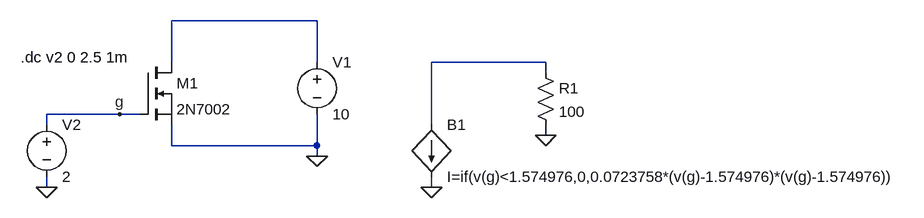
[diagram p0: schematic MOS curvas.asc]
MOS curvas.asc, the LTspice schematic file:
Version 4
SHEET 1 1440 680
WIRE 432 80 208 80
WIRE 208 144 208 80
WIRE 432 144 432 80
WIRE 784 144 608 144
WIRE 784 160 784 144
WIRE 128 224 16 224
WIRE 160 224 128 224
WIRE 16 240 16 224
WIRE 608 240 608 144
WIRE 784 256 784 240
WIRE 208 272 208 240
WIRE 432 272 432 224
WIRE 432 272 208 272
WIRE 432 288 432 272
WIRE 16 336 16 320
WIRE 608 336 608 320
FLAG 432 288 0
FLAG 16 336 0
FLAG 128 224 g
FLAG 608 336 0
FLAG 784 256 0
SYMBOL nmos 160 144 R0
SYMATTR InstName M1
SYMATTR Value 2N7002
SYMBOL voltage 432 128 R0
WINDOW 123 0 0 Left 2
WINDOW 39 0 0 Left 2
SYMATTR InstName V1
SYMATTR Value 10
SYMBOL voltage 16 224 R0
WINDOW 123 0 0 Left 2
WINDOW 39 0 0 Left 2
SYMATTR InstName V2
SYMATTR Value 2
SYMBOL bi 608 240 R0
SYMATTR InstName B1
SYMATTR Value I=if(v(g)<1.574976,0,0.0723758*(v(g)-1.574976)*(v(g)-1.574976))
SYMBOL res 768 144 R0
SYMATTR InstName R1
SYMATTR Value 100
TEXT -24 136 Left 2 !.dc v2 0 2.5 1m

The netlist it stands for:
* MOS curvas.asc
M1 N001 g 0 0 2N7002
V1 N001 0 10
V2 g 0 2
B1 N002 0 I=if(v(g)<1.574976,0,0.0723758*(v(g)-1.574976)*(v(g)-1.574976))
R1 N002 0 100
.model NMOS NMOS
.model PMOS PMOS
.lib standard.mos
.dc v2 0 2.5 1m
.backanno
.end